# EAGLE design pcb-bldc-sensorless2 (EAGLE 9.6.2)
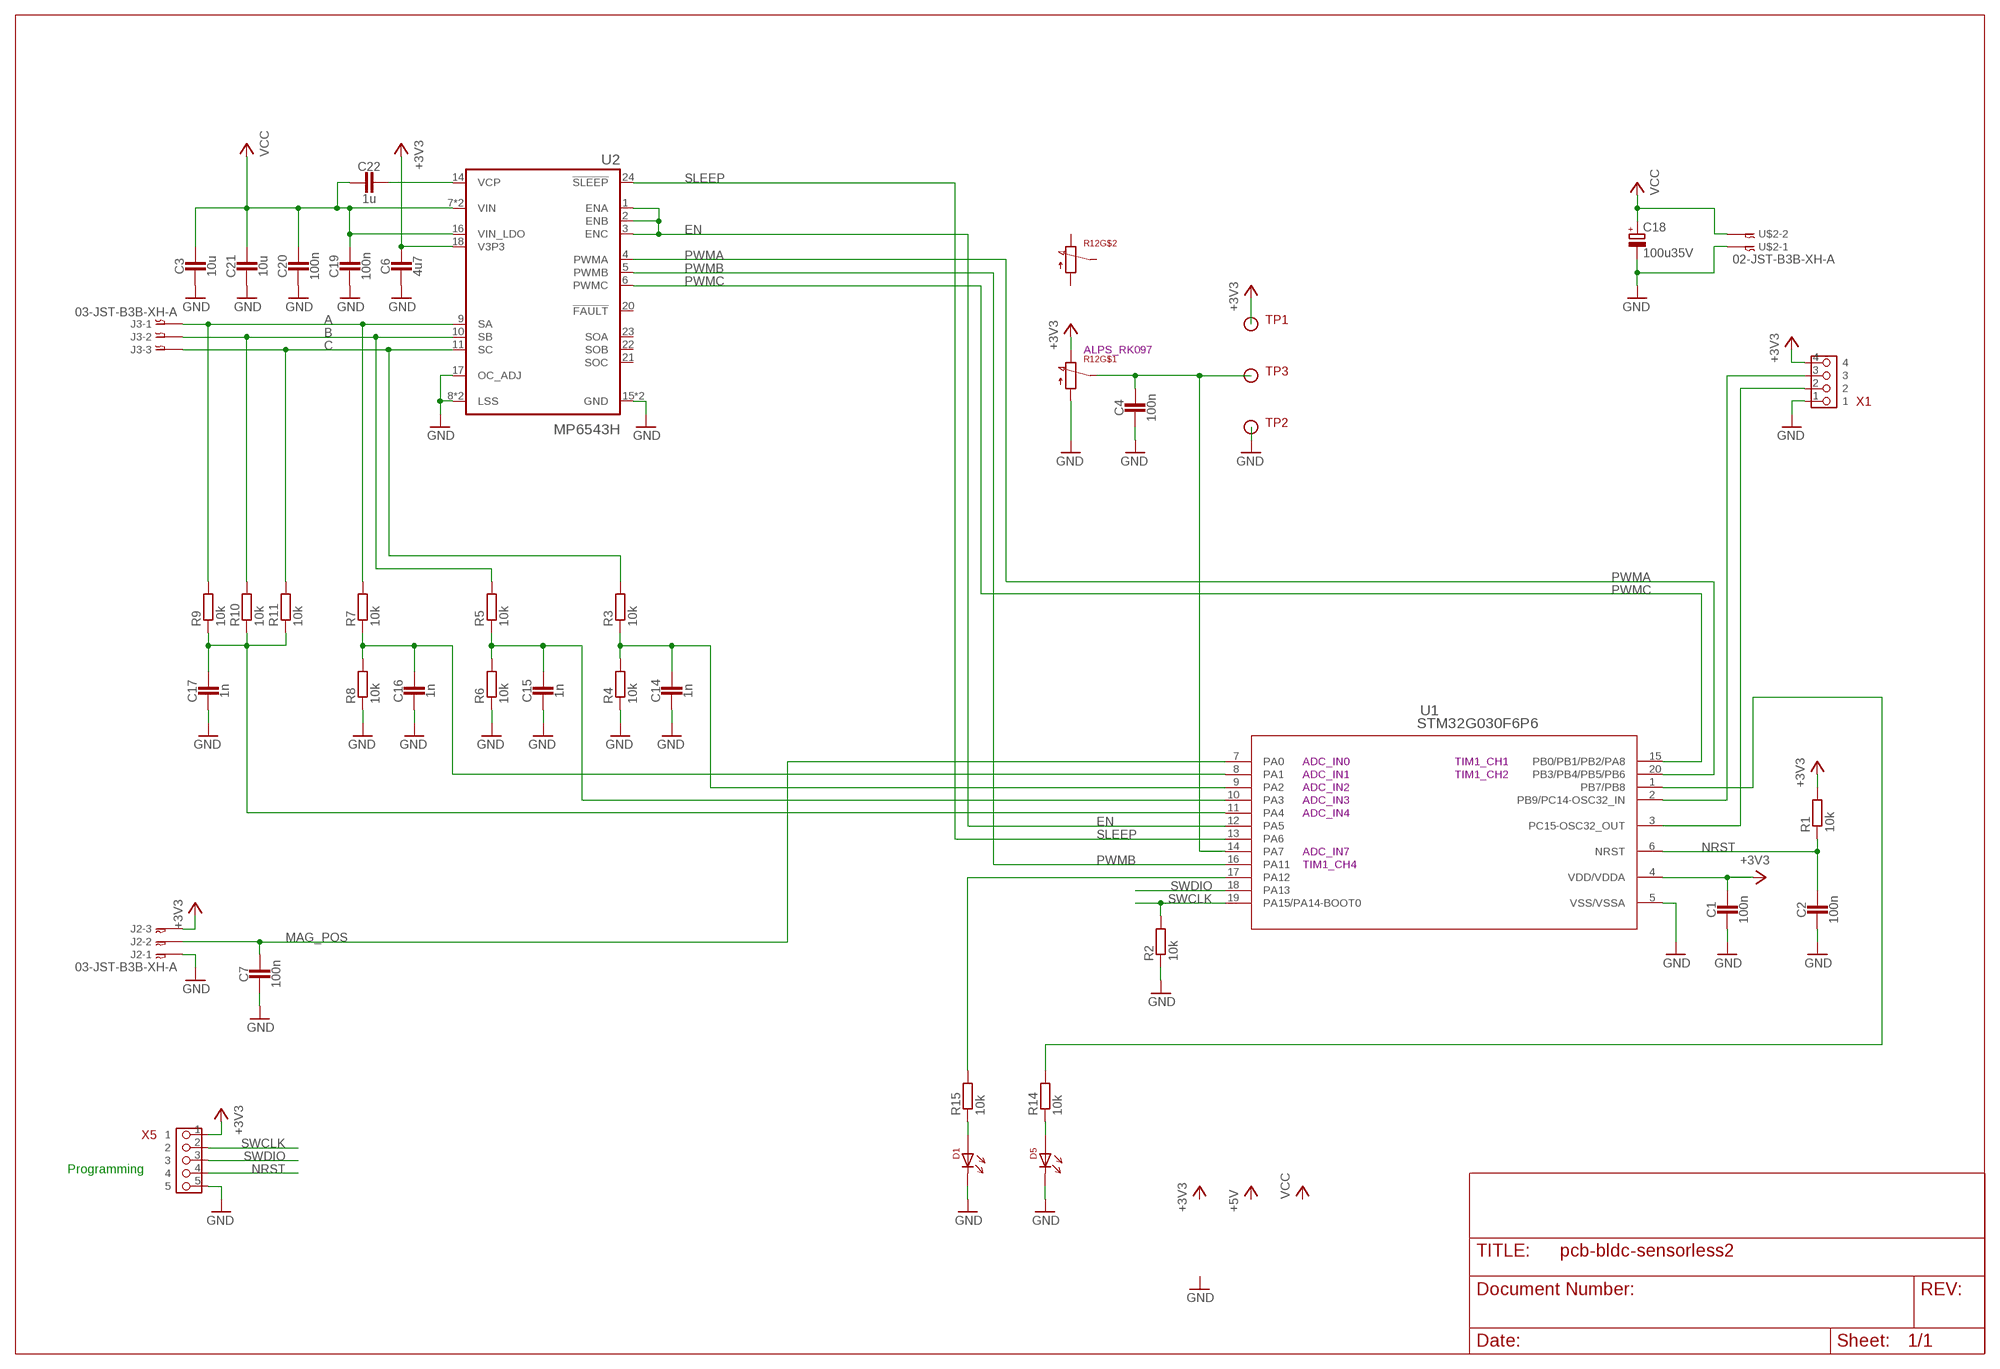
[diagram p0: schematic, sheet 1]

## Parts
C1  100n  CAPACITOR0603_CAP  [0603_CAP]
C2  100n  CAPACITOR0603_CAP  [0603_CAP]
C3  10u  CAPACITOR1206_CAP  [1206_CAP]
C4  100n  CAPACITOR0603_CAP  [0603_CAP]
C6  4u7  CAPACITOR0805_CAP  [0805_CAP]
C7  100n  CAPACITOR0603_CAP  [0603_CAP]
C14  1n  CAPACITOR0603_CAP  [0603_CAP]
C15  1n  CAPACITOR0603_CAP  [0603_CAP]
C16  1n  CAPACITOR0603_CAP  [0603_CAP]
C17  1n  CAPACITOR0603_CAP  [0603_CAP]
C18  100u35V  CPOL-EU153CLV-0605  [153CLV-0605]
C19  100n  CAPACITOR0603_CAP  [0603_CAP]
C20  100n  CAPACITOR0603_CAP  [0603_CAP]
C21  10u  CAPACITOR1206_CAP  [1206_CAP]
C22  1u  CAPACITOR0603_CAP  [0603_CAP]
D1  LED-0805  [0805-DOT]
D5  LED-0805  [0805-DOT]
J2  03-JST-B3B-XH-A  [B3B-XH]
J3  03-JST-B3B-XH-A  [B3B-XH]
R1  10k  RESISTOR0603_RES  [0603-RES]
R2  10k  RESISTOR0603_RES  [0603-RES]
R3  10k  RESISTOR0603_RES  [0603-RES]
R4  10k  RESISTOR0603_RES  [0603-RES]
R5  10k  RESISTOR0603_RES  [0603-RES]
R6  10k  RESISTOR0603_RES  [0603-RES]
R7  10k  RESISTOR0603_RES  [0603-RES]
R8  10k  RESISTOR0603_RES  [0603-RES]
R9  10k  RESISTOR0603_RES  [0603-RES]
R10  10k  RESISTOR0603_RES  [0603-RES]
R11  10k  RESISTOR0603_RES  [0603-RES]
R12  POTDUAL  [ALPS_RK097]
R14  10k  RESISTOR0603_RES  [0603-RES]
R15  10k  RESISTOR0603_RES  [0603-RES]
TP1  TESTPIN  [PIN-SMD-1X1-TEST_1M5]
TP2  TESTPIN  [PIN-SMD-1X1-TEST_1M5]
TP3  TESTPIN  [PIN-SMD-1X1-TEST_1M5]
U1  STM32G030F6P6  [TSSOP20]
U2  MP6543H  [QFN24]
U$2  02-JST-B3B-XH-A  [B2B-XH]
X1  PIN_4X1HD  [PIN_4X1_HD]
X5  PIN_5X1HD  [PIN_5X1_HD]

## Nets
+3V3: C1.1 C6.P$1 J2.P$3 R1.2 R12.R11 TP1.1 U1.4(VDD/VDDA) U2.18(V3P3) X1.4 X5.1
A: J3.P$1 R7.2 R9.2 U2.9(SA)
B: J3.P$2 R5.2 R10.2 U2.10(SB)
C: J3.P$3 R3.2 R11.2 U2.11(SC)
EN: U1.12(PA5) U2.1(ENA) U2.2(ENB) U2.3(ENC)
GND: C1.2 C2.2 C3.2 C4.2 C6.P$2 C7.2 C14.2 C15.2 C16.2 C17.2 C18.- C19.2 C20.2 C21.2 D1.2 D5.2 J2.P$1 R2.1 R4.1 R6.1 R8.1 R12.R13 TP2.1 U1.5(VSS/VSSA) U2.8(LSS) U2.12(LSS) U2.15(GND) U2.17(OC_ADJ) U2.25(GND) U$2.P$1 X1.1 X5.5
MAG_POS: C7.1 J2.P$2 U1.7(PA0)
N$1: C4.1 R12.R12 TP3.1 U1.14(PA7)
N$4: C14.1 R3.1 R4.2 U1.9(PA2)
N$6: C15.1 R5.1 R6.2 U1.10(PA3)
N$11: C17.1 R9.1 R10.1 R11.1 U1.11(PA4)
N$13: U1.3(PC15-OSC32_OUT) X1.2
N$14: D1.1 R15.1
N$15: C16.1 R7.1 R8.2 U1.8(PA1)
N$16: R15.2 U1.17(PA12)
N$17: R14.2 U1.1(PB7/PB8)
N$19: D5.1 R14.1
N$20: U1.2(PB9/PC14-OSC32_IN) X1.3
N$32: C22.1 U2.14(VCP)
NRST: C2.1 R1.1 U1.6(NRST) X5.4
PWMA: U1.20(PB3/PB4/PB5/PB6) U2.4(PWMA)
PWMB: U1.16(PA11) U2.5(PWMB)
PWMC: U1.15(PB0/PB1/PB2/PA8) U2.6(PWMC)
SLEEP: U1.13(PA6) U2.24(!SLEEP)
SWCLK: R2.2 U1.19(PA15/PA14-BOOT0) X5.2
SWDIO: U1.18(PA13) X5.3
VCC: C3.1 C18.+ C19.1 C20.1 C21.1 C22.2 U2.7(VIN) U2.13(VIN) U2.16(VIN_LDO) U$2.P$2
Unconnected: R12.R21 R12.R22 R12.R23 U2.20(!FAULT) U2.21(SOC) U2.22(SOB) U2.23(SOA)

## Notes on the sheet
- ALPS_RK097
- ADC_IN0 | TIM1_CH1
- ADC_IN1 | TIM1_CH2
- ADC_IN2
- ADC_IN3
- ADC_IN4
- ADC_IN7
- TIM1_CH4
- Programming

## Library data of the parts
C1-C4 C6 C7 C14-C17 C19-C22 = passives:CAPACITOR: SMD Capacitor
C18 = resistor:CPOL-EU: POLARIZED CAPACITOR, European symbol
D1 D5 = ftobler:LED
J2 J3 = bt_con-jst-xh:03-JST: JST CONNECTOR
R1-R11 R14 R15 = passives:RESISTOR: Resistor Basic schematic elements and footprints for 0201, 0402, 0603, 1206, and PTH resistors.
R12 = ftobler:POTDUAL
TP1-TP3 = ftobler:TESTPIN
U1 = stm32:STM32G030F6P6; COPYRIGHT: Copyright (C) 2024 Ultra Librarian. All rights reserved.; MANUFACTURER_PART_NUMBER: STM32G030F6P6; MFR_NAME: STMicroelectronics
U2 = ftobler:MP6543H
U$2 = bt_con-jst-xh:02-JST: JST CONNECTOR
X1 = ftobler-conn:PIN_4X1
X5 = ftobler-conn:PIN_5X1

## Board
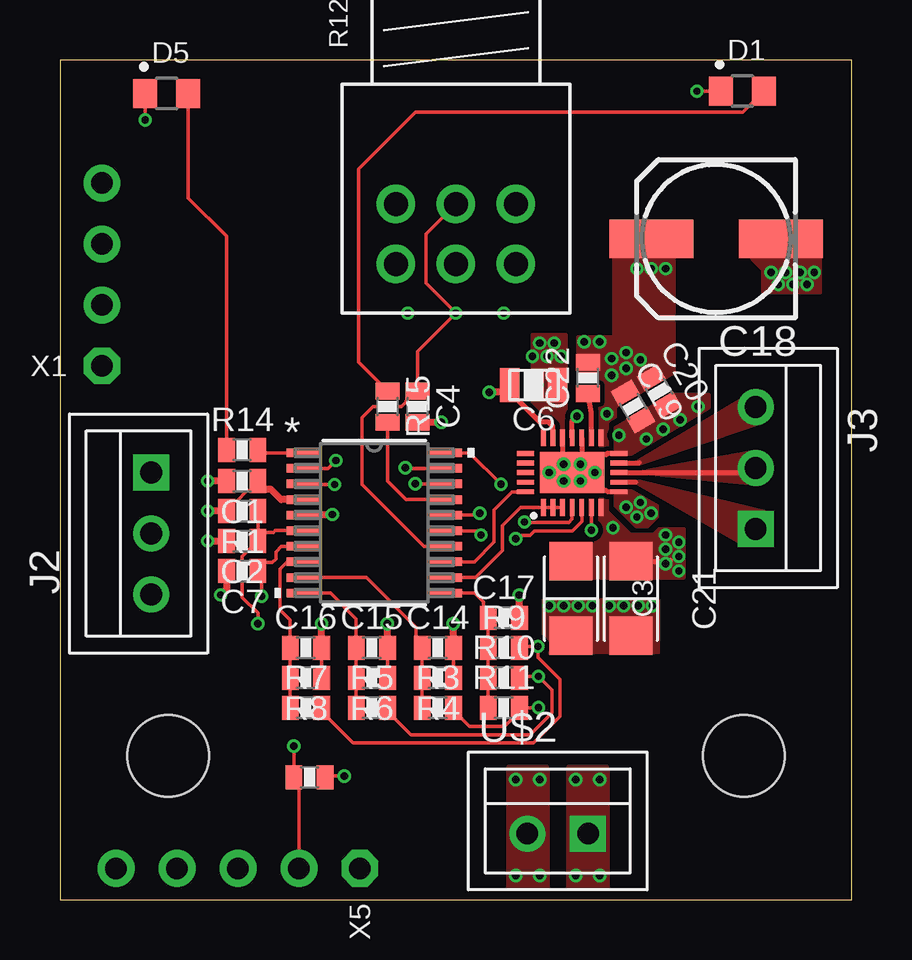
[diagram p1: board, top side]
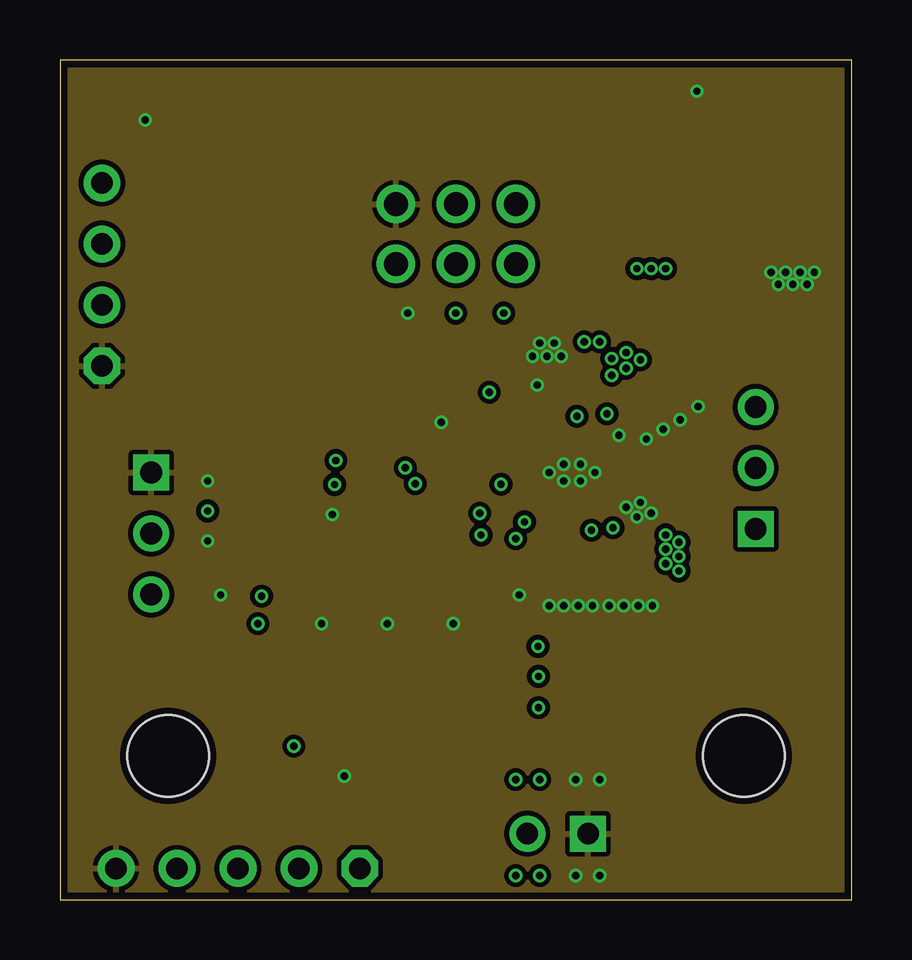
[diagram p2: board, inner layer Route2]
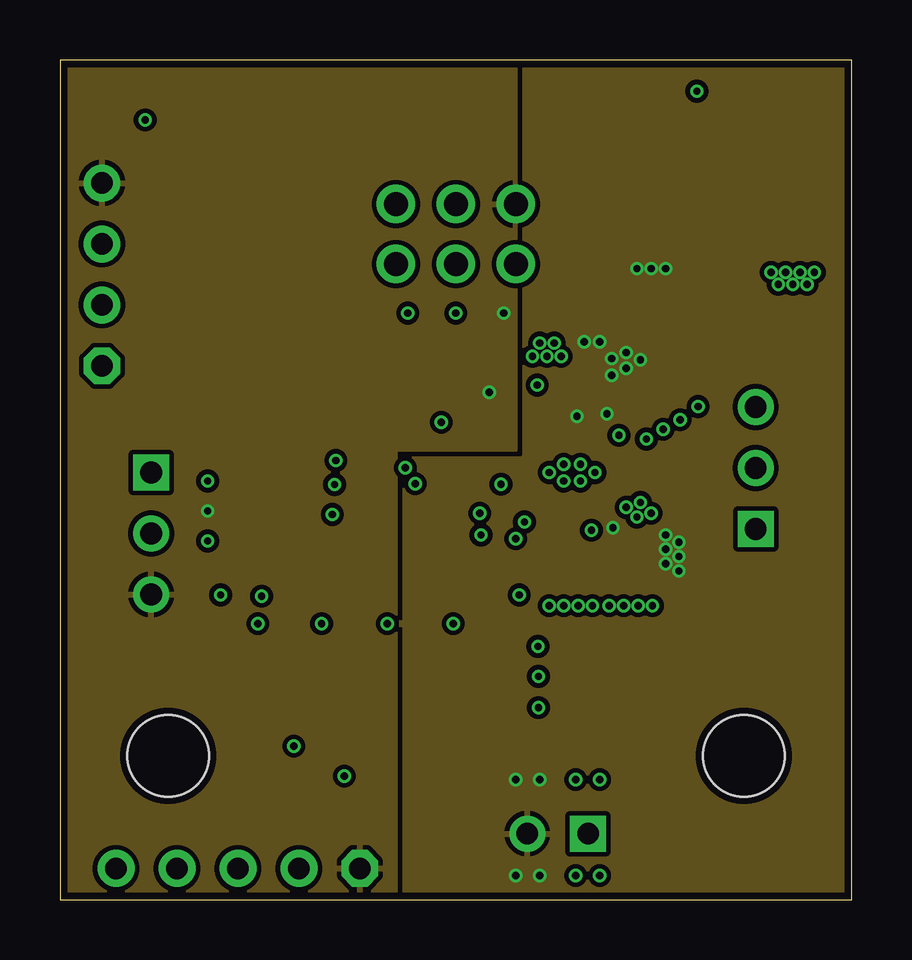
[diagram p3: board, inner layer Route15]
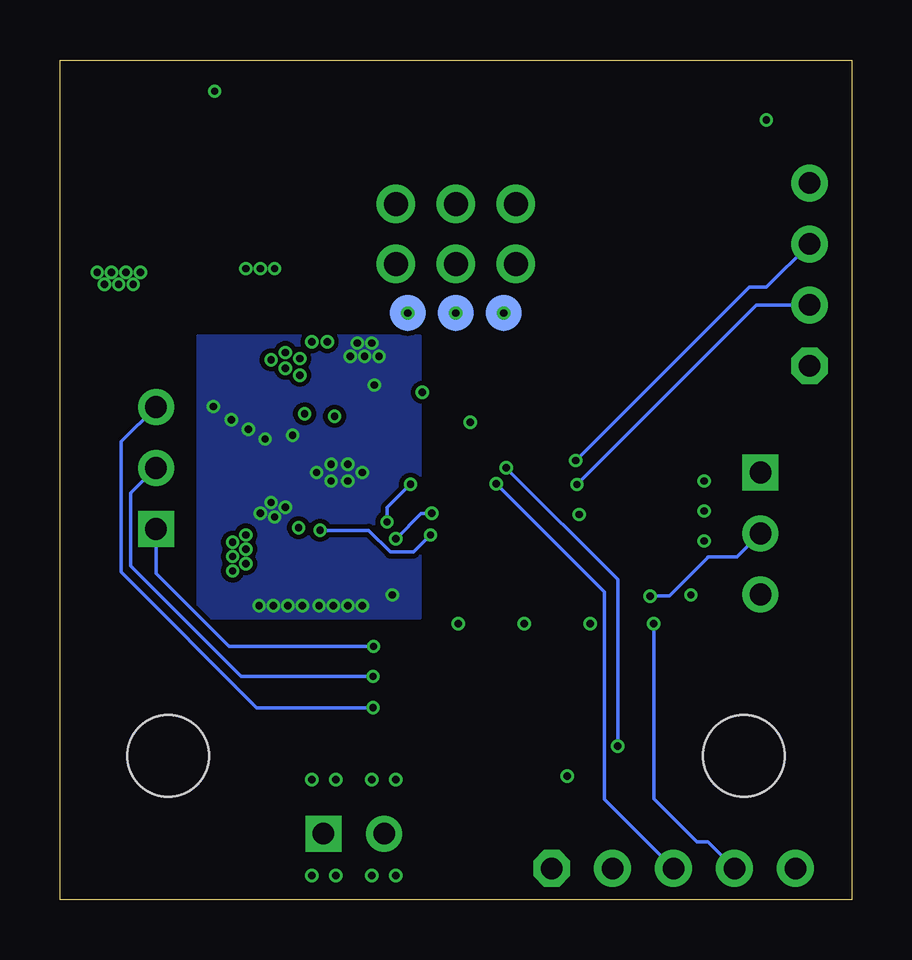
[diagram p4: board, bottom side, seen from below]

Size 33 x 35 mm. Coordinates in mm from the lower left corner, seen from the top.
Outline: 0,0 33,0 33,35 0,35 0,0
Copper layers (1+2*15+16): Top 0.035mm / dielectric 0.2mm / Route2 0.035mm / dielectric 0.4mm / Route15 0.035mm / dielectric 0.2mm / Bottom 0.035mm
Design rules "default *": minimum track width 0.15mm, minimum drill 0.2mm, track to track 0.2mm, track to pad 0.2mm, pad to pad 0.2mm, via to via 0.2mm, smd to smd 0.2mm, copper to edge 0.3mm, drill to drill 10mil, minimum pad ring 0.125mm, minimum via ring 0.125mm, stop-mask expansion 0.05mm, vias tented up to drill 0.35mm, thermal gap 0.2mm
Holes 3.4 mm at 4.5,6 28.5,6
tRestrict: area 25.2,2.7 to 31.8,9.3; area 1.2,2.7 to 7.8,9.3
bRestrict: area 25.2,2.7 to 31.8,9.3; area 1.2,2.7 to 7.8,9.3

### Footprints (pad centres in the part's own frame; a part is rotated, then mirrored left to right if it is on the bottom)
0603_CAP = smd 0.7 x 1: 1 -0.65,0; 2 0.65,0
1206_CAP = smd 1.6 x 1.8: 1 -1.55,0; 2 1.55,0
0805_CAP = smd 0.8 x 1.4: P$1 1,0; P$2 -1,0
153CLV-0605 = smd 3.5 x 1.6: + 2.7,0; - -2.7,0
0805-DOT = smd 1 x 1.2: 1 0.9,0; 2 -0.9,0
B3B-XH = drill 0.9 pad 1.5 square: P$1 2.54,0 | drill 0.9 pad 1.5: P$2 0,0; P$3 -2.54,0
0603-RES = smd 0.7 x 1: 1 -0.65,0; 2 0.65,0
ALPS_RK097 = drill 1 pad 1.6: R11 -5,-2.5; R12 -5,0; R13 -5,2.5; R21 -7.5,-2.5; R22 -7.5,0; R23 -7.5,2.5
PIN-SMD-1X1-TEST_1M5 = smd 1.5 x 1.5: 1 0,0
TSSOP20 = smd 1.462 x 0.355: 1 -2.921,2.925; 2 -2.921,2.275; 3 -2.921,1.625; 4 -2.921,0.975; 5 -2.921,0.325; 6 -2.921,-0.325; 7 -2.921,-0.975; 8 -2.921,-1.625; 9 -2.921,-2.275; 10 -2.921,-2.925; 11 2.921,-2.925; 12 2.921,-2.275; 13 2.921,-1.625; 14 2.921,-0.975; 15 2.921,-0.325; 16 2.921,0.325; 17 2.921,0.975; 18 2.921,1.625; 19 2.921,2.275; 20 2.921,2.925
QFN24 = smd 0.7 x 0.2: 1 -1.45,1.2; 2 -1.45,0.8; 3 -1.45,0.4; 4 -1.45,0; 5 -1.45,-0.4; 6 -1.45,-0.8; 7 -1.45,-1.2; 13 1.45,-1.2; 14 1.45,-0.8; 15 1.45,-0.4; 16 1.45,0; 17 1.45,0.4; 18 1.45,0.8; 19 1.45,1.2 | smd 0.2 x 0.7: 8 -0.8,-1.95; 9 -0.4,-1.95; 10 0,-1.95; 11 0.4,-1.95; 12 0.8,-1.95; 20 0.8,1.95; 21 0.4,1.95; 22 0,1.95; 23 -0.4,1.95; 24 -0.8,1.95 | smd 1.7 x 2.7: 25 0,0
B2B-XH = drill 0.9 pad 1.5 square: P$1 1.27,0 | drill 0.9 pad 1.5: P$2 -1.27,0
PIN_4X1_HD = drill 0.9 pad 1.54 octagon: 1 0,0 | drill 0.9 pad 1.54: 2 0,-2.54; 3 0,-5.08; 4 0,-7.62
PIN_5X1_HD = drill 0.9 pad 1.54 octagon: 1 0,0 | drill 0.9 pad 1.54: 2 0,-2.54; 3 0,-5.08; 4 0,-7.62; 5 0,-10.16

### Placement (x,y rotation side)
C1  7.6,17.45 180 top
C2  7.6,14.95 180 top
C3  21.3,12.55 270 top
C4  14.9,20.55 270 top
C6  19.75,21.45 180 top
C7  7.6,13.7 180 top
C14  15.75,10.5 0 top
C15  13,10.5 0 top
C16  10.25,10.5 0 top
C17  18.5,11.75 0 top
C18  27.35,27.55 180 top
C19  23.89,20.55 300 top
C20  24.98,21.18 300 top
C21  23.8,12.55 270 top
C22  22,21.75 90 top
D1  28.45,33.7 0 top
D5  4.45,33.6 0 top
J2  3.8,15.26 90 top
J3  29,17.99 270 top
R1  7.6,16.2 180 top
R2  10.4,5.1 180 top
R3  15.75,8 0 top
R4  15.75,9.25 180 top
R5  13,8 0 top
R6  13,9.25 180 top
R7  10.25,8 0 top
R8  10.25,9.25 180 top
R9  18.5,10.5 0 top
R10  18.5,9.25 0 top
R11  18.5,8 0 top
R12  16.5,34 90 top
R14  7.6,18.75 0 top
R15  13.65,20.55 270 top
TP1  18.5,24.45 180 bottom
TP2  14.5,24.45 180 bottom
TP3  16.5,24.45 180 bottom
U1  13.1,15.7 0 top
U2  21.35,17.8 90 top
U$2  20.75,2.75 0 top
X1  1.75,22.25 180 top
X5  12.5,1.3 270 top

### Tracks (layer width: path | path; a pad name or v marks a point on that pad's centre or on a via)
+3V3  (via drill 0.3)
  Top 0.15: R1.2 6.95,16.35 7.2,16.6 7.36,16.6 7.81,17.05 8,17.05 8.25,17.3 C1.1
  Top 0.2: U2.18 20.55,19.72 20.37,19.9 20,19.9 18.75,21.15
  Top 0.3: R1.2 v6.15,16.2 | U1.4 9.22,16.68 8.8,17.1 8.35,17.1 8.25,17.2 8.25,17.3 | C6.P$1 18.75,21.15 v17.9,21.15
  other vias: 18.5,24.45
  pour Route15: -1,-1 14,-1 14,18.75 19,18.75 19,43.45 -1,43.45
A  (via drill 0.3)
  Top 0.15: R9.2 19.2,10.55 v19.93,10.55 19.93,10.1 20.85,9.18 20.85,7.63 19.75,6.53 12.22,6.53 10.9,7.85 R7.2
  Top 0.2: U2.9 24,17.4 | 28.85,15.46 J3.P$1
  Bottom 0.15: J3.P$1 29,13.6 25.95,10.55 v19.93,10.55
  pour Top (rank 2, no thermals): 24.2,17.4 29.51,16.11 28.41,14.87 23.99,17.4
B  (via drill 0.3)
  Top 0.15: R10.2 19.2,9.3 v19.95,9.3 20.5,8.75 20.5,7.77 19.6,6.88 14.62,6.88 13.65,7.85 R5.2
  Top 0.2: U2.10 28.8,17.8 J3.P$2
  Bottom 0.15: J3.P$2 30.05,16.95 30.05,13.9 25.45,9.3 v19.95,9.3
  pour Top (rank 3, no thermals): 24.15,17.8 28.95,18.65 28.95,17.35
C  (via drill 0.3)
  Top 0.15: R11.2 19.2,8 | 19.2,8 v19.95,8 | R3.2 16.4,7.9 17.07,7.22 18.52,7.22 19.2,7.9 19.2,8
  Top 0.2: U2.11 24.15,18.2
  Bottom 0.15: J3.P$3 30.45,19.09 30.45,13.65 24.8,8 v19.95,8
  pour Top (no thermals): 24.02,18.2 28.66,20.97 29.16,19.89 24.2,18.2
EN
  Top 0.15: U1.12 17.32,13.43 18.45,14.55 18.45,15.6 19.2,16.35 U2.1 U2.2 U2.3
GND  (via drill 0.3)
  Top 0.15: R8.1 C16.2 | R6.1 C15.2 | R4.1 C14.2 | D5.2 v3.55,32.5 | D1.2 v26.55,33.7 | v11.85,5.15 11.1,5.15 R2.1
  Top 0.2: U2.17 20.95,18.2 U2.25 21.75,18.2 U2.15 | U2.12 22.83,18.6 22.78,18.55 22.55,18.55 22.55,18.5 | U2.8 22.83,17 22.78,17.05 22.55,17.05 22.4,17.2
  Top 0.3: C16.2 v10.9,11.5 | C15.2 v13.65,11.5 | C14.2 v16.4,11.5 | C17.2 v19.15,12.7 | C1.2 v6.15,17.45 | U1.5 10.2,16.05 v11.35,16.05 | C7.2 6.95,12.95 v6.7,12.7 | v6.15,14.95 C2.2 | C4.2 v15.9,19.9
  other vias: 24.45,19.2 25.15,19.6 25.85,20 23.3,19.35 26.6,20.55 23.6,16.35 24.2,16.55 24.05,15.95 21,12.25 21.6,12.25 23.5,12.25 24.1,12.25 24.7,12.25 22.9,12.25 22.2,12.25 20.4,12.25 20.9,22.65 20.3,22.65 19.7,22.65 20.6,23.2 19.9,21.45 20,23.2 24.65,16.1 31.45,26.15 30.85,26.15 30.25,26.15 21.7,18.15 21.7,17.45 21,17.45 21,18.15 22.3,17.8 20.4,17.8 31.15,25.65 30.55,25.65 29.95,25.65 29.65,26.15 14.5,24.45 21.5,5 22.5,5 22.5,1 21.5,1
  pour Top (rank 3, no thermals): 23.15,17.15 24.9,17.15 24.9,15.95 24.5,15.55 24,15.55 23.15,16.4
  pour Top (rank 3, no thermals): 27.05,19.85 27.05,21.05 25.55,21.05 23.15,19.65 23.15,18.35 24.35,18.35
  pour Top (no thermals): 21.1,23.55 19.7,23.55 19.7,19 21.1,19
  pour Top (no thermals): 20.15,10.3 24.95,10.3 24.95,12.5 20.15,12.5
  pour Top (no thermals): 31.7,25.3 31.7,27.9 31.45,28.15 28.4,28.15 28.4,27.15 29.3,26.25 29.3,25.3
  pour Bottom: 18,11.75 27.25,11.75 27.25,23.5 18,23.5
  pour Route2: -0.55,42.9 34.15,42.9 34.15,-1.05 -0.55,-1.05
  pour Top (no thermals): 21.25,5.5 22.75,5.5 22.75,0.5 21.25,0.5
MAG_POS  (via drill 0.3)
  Top 0.15: U1.7 9.22,14.72 9,14.5 9,14.2 8.85,14.05 8.6,14.05 C7.1 8.4,13.55 v8.4,12.65
  Bottom 0.15: v8.4,12.65 7.6,12.65 5.98,14.27 5.98,14.28 4.78,14.28 J2.P$2
N$1  (via drill 0.3)
  Top 0.15: U1.14 15.18,14.72 12.6,17.3 12.6,20.09 13.06,20.55 14.24,20.55 14.43,20.74 14.43,20.77 14.85,21.2 C4.1 14.9,22.85 TP3.1 15.25,25.7 15.25,27.75 R12.R12
  other vias: 16.5,24.45
N$4
  Top 0.15: U1.9 12.78,13.43 14.85,11.35 14.85,10.65 15,10.5 C14.1 R4.2 R3.1
N$6
  Top 0.15: R5.1 R6.2 C15.1 12.35,11.7 11.28,12.78 U1.10
N$11
  Top 0.15: C17.1 17.85,11.65 | 17.85,11.65 R9.1 R10.1 R11.1 | U1.11 17.27,12.78 17.65,12.4 17.65,11.85 17.85,11.65
N$13  (via drill 0.3)
  Top 0.15: v11.45,17.3 10.2,17.3 U1.3
  Bottom 0.15: X1.2 3.96,24.79 v11.45,17.3
N$14
  Top 0.15: R15.1 12.45,22.4 12.45,30.45 14.82,32.83 28.48,32.83 D1.1
N$15
  Top 0.15: U1.8 9.47,14.07 9.17,13.77 9.17,12.08 9.6,11.65 C16.1 R8.2 R7.1
N$16
  Top 0.15: R15.2 13.65,17.45 14.43,16.68 U1.17
N$17
  Top 0.15: R14.2 8.38,18.62 U1.1
N$19
  Top 0.15: D5.1 5.35,29.25 6.95,27.65 R14.1
N$20  (via drill 0.3)
  Top 0.15: U1.2 11.18,17.98 v11.5,18.3
  Bottom 0.15: X1.3 3.55,25.53 4.27,25.53 v11.5,18.3
N$32
  Top 0.2: U2.14 22.15,20.3 C22.1
NRST  (via drill 0.3)
  Top 0.15: R1.1 C2.1 | C2.1 8.6,15.3 8.9,15.3 8.97,15.38 U1.6 | C2.1 7.6,14.3 7.6,12.6 8.25,11.95 v8.25,11.5
  Bottom 0.15: X5.4 5.98,2.4 6.45,2.4 8.25,4.2 v8.25,11.5
PWMA  (via drill 0.3)
  Top 0.15: U1.20 17.07,18.62 v18.39,17.31 | U2.4 21.35,15.86 21.21,15.72 19.38,15.72 v19.36,15.74
  Bottom 0.15: v18.39,17.31 19.36,16.34 v19.36,15.74
PWMB  (via drill 0.3)
  Top 0.15: U1.16 17.43,16.02 v17.5,16.1 | v19,15.04 19.15,15.19 19.59,15.19 19.78,15.38 21.36,15.38 21.75,15.77 U2.5
  Bottom 0.15: v17.5,16.1 17.94,16.1 v19,15.04
PWMC  (via drill 0.3)
  Top 0.15: U2.6 v22.15,15.4 v22.16,15.39 | v17.55,15.2 17.38,15.38 U1.15
  Bottom 0.15: v22.16,15.39 20.13,15.39 19.23,14.49 18.26,14.49 v17.55,15.2
SLEEP
  Top 0.15: U1.13 17.27,14.07 18.1,14.9 18.1,16.25 18.85,17 U2.24
SWCLK  (via drill 0.3)
  Top 0.15: X5.2 9.96,5.04 9.75,5.25 R2.2 v9.75,6.4 | U1.19 14.43,17.98 v14.4,18
  Bottom 0.15: v14.4,18 9.75,13.35 v9.75,6.4
SWDIO  (via drill 0.3)
  Top 0.15: U1.18 14.82,17.32 v14.81,17.34
  Bottom 0.15: v14.81,17.34 10.3,12.82 10.3,4.17 X5.3
VCC  (via drill 0.3)
  Top 0.2: U2.16 21.35,19.95 v21.55,20.15 | C21.1 25.4,14.1 25.45,14.15
  other vias: 23.05,15.5 25.25,15.2 25.25,14.6 25.25,14 25.8,14.9 25.8,14.3 25.8,13.7 23,21.85 23.6,22.15 23,22.55 21.85,23.25 22.5,23.25 24.2,22.5 23.6,22.8 25.25,26.3 24.65,26.3 24.05,26.3 19,5 20,5 20,1 19,1 22.8,20.25
  pour Top (rank 4, no thermals): 22.35,17.05 24.65,17.05 24.65,15.45 26,15.45 26,13.4 20.5,13.4 20.5,14.8 22.05,14.8 22.35,14.8
  pour Top (rank 4, no thermals): 21.6,23.45 25.6,23.45 25.6,21.98 23.15,20.55 23.15,18.9 22.35,18.9 22.35,21.9 21.6,21.9
  pour Route15 (rank 2): -1,43 34,43 34,-1 -1,-1
  pour Top (no thermals): 23.1,26.95 23.1,23.2 25.6,23.2 25.6,26.95
  pour Top (no thermals): 18.75,5.5 20.25,5.5 20.25,0.5 18.75,0.5

### Text on the board
tFinish: JLCJLCJLCJLC | 3 | + | .2 | .3 | G | pcb-bldc- / sensorless v2 / by ftobler 2024 | G | ADC | 3 | G | R | D | C | 3 | VCC | GND